# Altium schematic sheet Lab7-8_CH3.SchDoc
size B; DrawnBy: Aaron Huinink; SheetNumber: 4; SheetTotal: 5
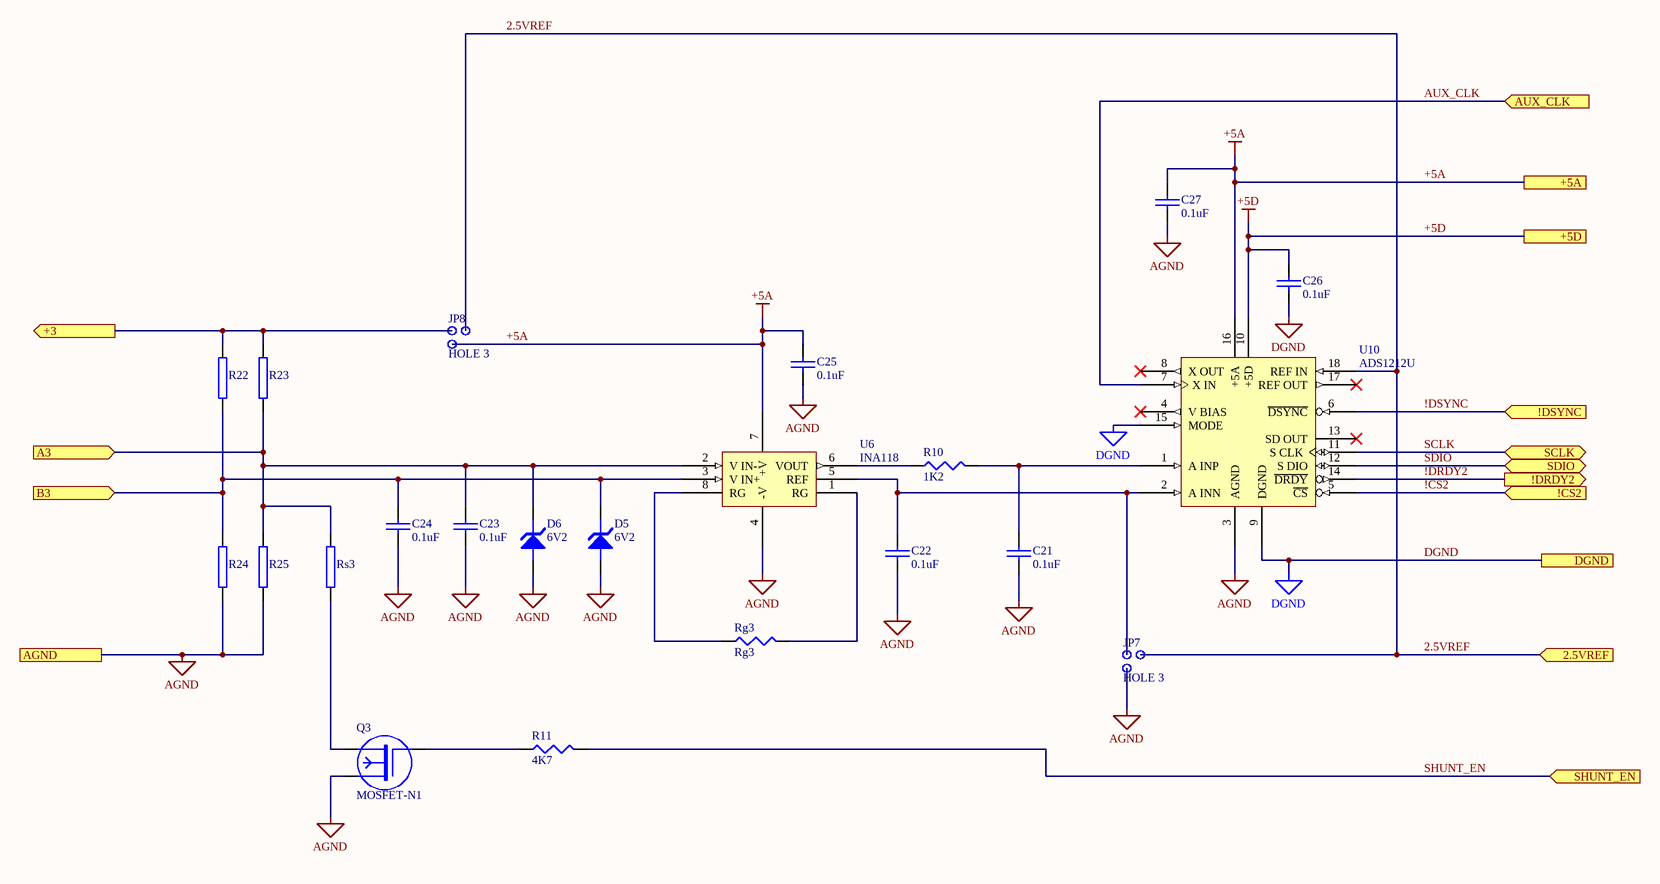
[diagram p0: Lab7-8_CH3.SchDoc]

## Parts
C21  0.1uF  [0805]
C22  0.1uF  [0805]
C23  0.1uF  [0805]
C24  0.1uF  [0805]
C25  0.1uF  [0805]
C26  0.1uF  [0805]
C27  0.1uF  [0805]
D5  6V2  [SOD-123]
D6  6V2  [SOD-123]
JP7  HOLE 3  [RAD0.1A]
JP8  HOLE 3  [RAD0.1A]
Q3  MOSFET-N1  [SOT-23]
R10  1K2  [0805]
R11  4K7  [0805]
R22  bridge R  [bridge resistor]  (value not drawn)
R23  bridge R  [bridge resistor]  (value not drawn)
R24  bridge R  [bridge resistor]  (value not drawn)
R25  bridge R  [bridge resistor]  (value not drawn)
Rg3  Rg3  [0805]
Rs3  bridge R  [bridge resistor]  (value not drawn)
U6  INA118  [SO-8]
U10  ADS1212U  [SOIC18]

## Ports
2.5VREF (in, see Lab7-8_TOP[4B], Lab7-8_CH1[5C], Lab7-8_CH2[6C], Lab7-8_CH4[6C]), !CS2 (in, see Lab7-8_TOP[4B]), !DRDY2 (out, see Lab7-8_TOP[4B]), !DSYNC (in, see Lab7-8_TOP[4B], Lab7-8_CH1[5B], Lab7-8_CH2[5B], Lab7-8_CH4[5B]), +3 (out, see Lab7-8_TOP[3B]), +5A (see Lab7-8_TOP[4B], Lab7-8_CH1[5B], Lab7-8_CH2[6B], Lab7-8_CH4[6B]), +5D (see Lab7-8_TOP[4B], Lab7-8_CH1[5B], Lab7-8_CH2[6B], Lab7-8_CH4[6B]), A3 (in, see Lab7-8_TOP[3B]), AGND (see Lab7-8_TOP[3B], Lab7-8_CH1[1C], Lab7-8_CH2[1C], Lab7-8_CH4[1C]), AUX_CLK (in, see Lab7-8_TOP[4B], Lab7-8_CH1[5A], Lab7-8_CH2[5A], Lab7-8_CH4[5A]), B3 (in, see Lab7-8_TOP[3B]), DGND (see Lab7-8_TOP[4B], Lab7-8_CH1[5C], Lab7-8_CH2[6C], Lab7-8_CH4[6C]), SCLK (bidir, see Lab7-8_TOP[4B], Lab7-8_CH1[5B], Lab7-8_CH2[5B], Lab7-8_CH4[5B]), SDIO (bidir, see Lab7-8_TOP[4B], Lab7-8_CH1[5B], Lab7-8_CH2[5B], Lab7-8_CH4[5B]), SHUNT_EN (in, see Lab7-8_TOP[4B], Lab7-8_CH1[5C], Lab7-8_CH2[6C], Lab7-8_CH4[6C])

## Nets
+5A: C25.1 C27.1 JP8.1 U6.7(+V) U10.16(+5A) ; port +5A  [also labelled +V]
+5D: C26.1 U10.10(+5D) ; port +5D
-V: C21.2 C22.2 C23.2 C24.2 C25.2 C27.2 D5.A D6.A JP7.1 Q3.2 R24.1 R25.1 U6.4(-V) U10.3(AGND) ; port AGND  [also labelled AGND]
DGND: C26.2 U10.9(DGND) U10.15(MODE) ; port DGND
2.5VREF: JP7.3 JP8.3 U10.18(REF_IN) ; port 2.5VREF
!CS2: U10.5(~{CS}) ; port !CS2
!DRDY2: U10.14(~{DRDY}) ; port !DRDY2
!DSYNC: U10.6(~{DSYNC}) ; port !DSYNC
+3: JP8.2 R22.2 R23.2 ; port +3
A3: C23.1 D6.K R23.1 R25.2 Rs3.2 U6.2(V_IN-) ; port A3
AUX_CLK: U10.7(X_IN) ; port AUX_CLK
B3: C24.1 D5.K R22.1 R24.2 U6.3(V_IN+) ; port B3
SCLK: U10.11(S_CLK) ; port SCLK
SDIO: U10.12(S_DIO) ; port SDIO
SHUNT_EN: R11.2 ; port SHUNT_EN
NetC21_1: C21.1 R10.2 U10.1(A_INP)
NetC22_1: C22.1 JP7.2 U6.5(REF) U10.2(A_INN)
NetQ3_1: Q3.1 R11.1
NetQ3_3: Q3.3 Rs3.1
NetR10_1: R10.1 U6.6(VOUT)
NetRg3_1: Rg3.1 U6.8(RG)
NetRg3_2: Rg3.2 U6.1(RG)

Not connected (* = marked no-connect by the designer): U10 4(V_BIAS)* 8(X_OUT)* 13(SD_OUT)* 17(REF_OUT)*

## Notes on the sheet
- Title
- Size:
- Date:
- A
- Number:
- Time:
- Revision:
- Sheet
- of
- File:

## Library data of the parts
C21-C27 = CAP
D5 D6 = ZENER3
R10 R11 Rg3 = RES1
R22-R25 Rs3 = RES2
U6 = INA118: Precision, Low Power Instrumentation Amplifier
U10 = ADS1212U(18): 22-Bit Analog-to-Digital Converter